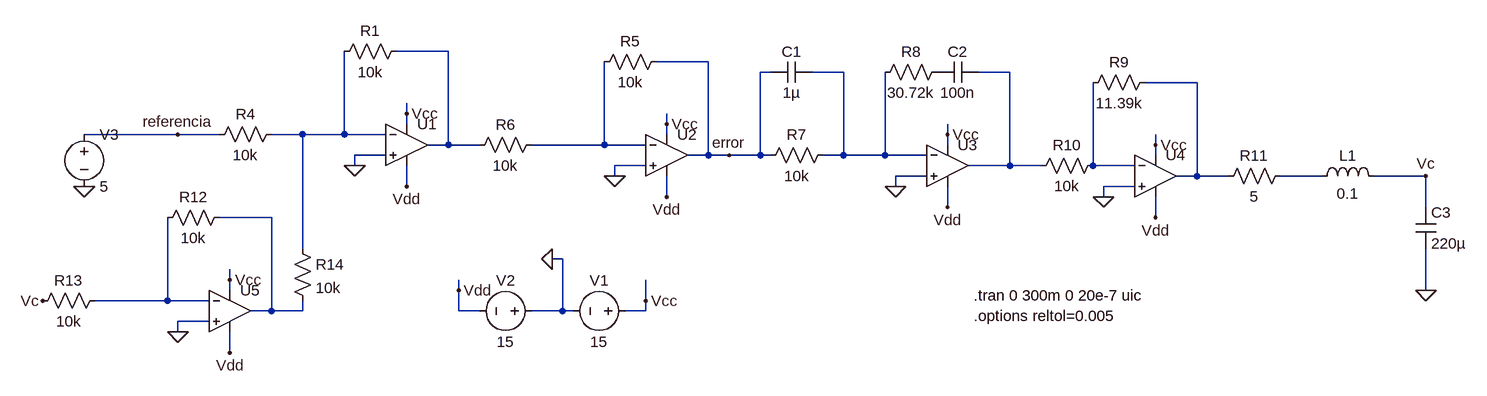
[diagram p0: schematic PID_circuito.asc]
PID_circuito.asc, the LTspice schematic file:
Version 4.1
SHEET 1 4532 732
WIRE 368 -16 288 -16
WIRE 768 0 688 0
WIRE 864 16 848 16
WIRE 976 16 928 16
WIRE 1232 16 1184 16
WIRE 1520 32 1440 32
WIRE 304 80 304 64
WIRE 304 96 304 80
WIRE 704 96 704 80
WIRE -48 112 -192 112
WIRE 16 112 -48 112
WIRE 144 112 96 112
WIRE 208 112 208 -16
WIRE 208 112 144 112
WIRE 272 112 208 112
WIRE 704 112 704 96
WIRE 1136 112 1136 96
WIRE 368 128 368 -16
WIRE 368 128 336 128
WIRE 416 128 368 128
WIRE 608 128 608 0
WIRE 608 128 496 128
WIRE 672 128 608 128
WIRE 1136 128 1136 112
WIRE 1456 128 1456 112
WIRE 272 144 224 144
WIRE 768 144 768 0
WIRE 768 144 736 144
WIRE 800 144 768 144
WIRE 848 144 848 16
WIRE 848 144 800 144
WIRE 864 144 848 144
WIRE 976 144 976 16
WIRE 976 144 944 144
WIRE 1040 144 1040 16
WIRE 1040 144 976 144
WIRE 1104 144 1040 144
WIRE 1456 144 1456 128
WIRE 224 160 224 144
WIRE 672 160 624 160
WIRE 1232 160 1232 16
WIRE 1232 160 1168 160
WIRE 1280 160 1232 160
WIRE 1360 160 1360 32
WIRE 1424 160 1360 160
WIRE 624 176 624 160
WIRE 1104 176 1056 176
WIRE 1520 176 1520 32
WIRE 1520 176 1488 176
WIRE 1568 176 1520 176
WIRE 1712 176 1648 176
WIRE 1872 176 1792 176
WIRE 304 192 304 160
WIRE 1056 192 1056 176
WIRE 1424 192 1376 192
WIRE 704 208 704 176
WIRE 1376 208 1376 192
WIRE 1136 224 1136 192
WIRE 1872 224 1872 176
WIRE 96 240 16 240
WIRE 1456 240 1456 208
WIRE 144 288 144 112
WIRE 544 304 528 304
WIRE 32 336 32 320
WIRE 32 352 32 336
WIRE 384 352 384 336
WIRE 1872 352 1872 288
WIRE -64 368 -64 240
WIRE -64 368 -176 368
WIRE 0 368 -64 368
WIRE 672 368 672 336
WIRE 96 384 96 240
WIRE 96 384 64 384
WIRE 144 384 144 368
WIRE 144 384 96 384
WIRE 384 384 384 352
WIRE 416 384 384 384
WIRE 544 384 544 304
WIRE 544 384 496 384
WIRE 560 384 544 384
WIRE 672 384 672 368
WIRE 672 384 640 384
WIRE 0 400 -48 400
WIRE -48 416 -48 400
WIRE 32 448 32 416
FLAG 304 192 Vdd
FLAG 304 80 Vcc
FLAG 224 160 0
FLAG 528 304 0
FLAG 672 368 Vcc
FLAG 384 352 Vdd
FLAG 704 208 Vdd
FLAG 704 96 Vcc
FLAG 624 176 0
FLAG 1136 224 Vdd
FLAG 1136 112 Vcc
FLAG 1056 192 0
FLAG 1456 240 Vdd
FLAG 1456 128 Vcc
FLAG 1376 208 0
FLAG 1872 352 0
FLAG 1872 176 Vc
FLAG 32 448 Vdd
FLAG 32 336 Vcc
FLAG -48 416 0
FLAG -256 368 Vc
FLAG 800 144 error
FLAG -192 192 0
FLAG -48 112 referencia
SYMBOL res 304 -32 R90
WINDOW 0 0 56 VBottom 2
WINDOW 3 32 56 VTop 2
SYMATTR InstName R1
SYMATTR Value 10k
SYMBOL OpAmps\\UniversalOpAmp2 304 128 R0
SYMATTR InstName U1
SYMBOL voltage 656 384 R90
WINDOW 0 -32 56 VBottom 2
WINDOW 3 32 56 VTop 2
SYMATTR InstName V1
SYMATTR Value 15
SYMBOL voltage 512 384 R90
WINDOW 0 -32 56 VBottom 2
WINDOW 3 32 56 VTop 2
SYMATTR InstName V2
SYMATTR Value 15
SYMBOL res 112 96 R90
WINDOW 0 0 56 VBottom 2
WINDOW 3 32 56 VTop 2
SYMATTR InstName R4
SYMATTR Value 10k
SYMBOL res 704 -16 R90
WINDOW 0 0 56 VBottom 2
WINDOW 3 32 56 VTop 2
SYMATTR InstName R5
SYMATTR Value 10k
SYMBOL OpAmps\\UniversalOpAmp2 704 144 R0
SYMATTR InstName U2
SYMBOL res 512 112 R90
WINDOW 0 0 56 VBottom 2
WINDOW 3 32 56 VTop 2
SYMATTR InstName R6
SYMATTR Value 10k
SYMBOL res 960 128 R90
WINDOW 0 0 56 VBottom 2
WINDOW 3 32 56 VTop 2
SYMATTR InstName R7
SYMATTR Value 10k
SYMBOL cap 928 0 R90
WINDOW 0 0 32 VBottom 2
WINDOW 3 32 32 VTop 2
SYMATTR InstName C1
SYMATTR Value 1µ
SYMBOL res 1136 0 R90
WINDOW 0 0 56 VBottom 2
WINDOW 3 32 56 VTop 2
SYMATTR InstName R8
SYMATTR Value 30.72k
SYMBOL OpAmps\\UniversalOpAmp2 1136 160 R0
SYMATTR InstName U3
SYMBOL cap 1184 0 R90
WINDOW 0 0 32 VBottom 2
WINDOW 3 32 32 VTop 2
SYMATTR InstName C2
SYMATTR Value 100n
SYMBOL res 1456 16 R90
WINDOW 0 0 56 VBottom 2
WINDOW 3 32 56 VTop 2
SYMATTR InstName R9
SYMATTR Value 11.39k
SYMBOL OpAmps\\UniversalOpAmp2 1456 176 R0
SYMATTR InstName U4
SYMBOL res 1376 144 R90
WINDOW 0 0 56 VBottom 2
WINDOW 3 32 56 VTop 2
SYMATTR InstName R10
SYMATTR Value 10k
SYMBOL res 1664 160 R90
WINDOW 0 0 56 VBottom 2
WINDOW 3 32 56 VTop 2
SYMATTR InstName R11
SYMATTR Value 5
SYMBOL ind 1696 192 R270
WINDOW 0 32 56 VTop 2
WINDOW 3 5 56 VBottom 2
SYMATTR InstName L1
SYMATTR Value 0.1
SYMBOL cap 1856 224 R0
SYMATTR InstName C3
SYMATTR Value 220µ
SYMBOL res 32 224 R90
WINDOW 0 0 56 VBottom 2
WINDOW 3 32 56 VTop 2
SYMATTR InstName R12
SYMATTR Value 10k
SYMBOL OpAmps\\UniversalOpAmp2 32 384 R0
SYMATTR InstName U5
SYMBOL res -160 352 R90
WINDOW 0 0 56 VBottom 2
WINDOW 3 32 56 VTop 2
SYMATTR InstName R13
SYMATTR Value 10k
SYMBOL res 128 272 R0
SYMATTR InstName R14
SYMATTR Value 10k
SYMBOL voltage -192 96 R0
WINDOW 123 0 0 Left 0
WINDOW 39 0 0 Left 0
SYMATTR InstName V3
SYMATTR Value 5
TEXT 1176 360 Left 2 !.tran 0 300m 0 20e-7 uic\n.options reltol=0.005

The netlist it stands for:
* PID_circuito.asc
R1 N001 N005 10k
X§U1 0 N005 Vcc Vdd N001 level2 Avol=1Meg GBW=10Meg Slew=10Meg Ilimit=25m Rail=0 Vos=0 En=0 Enk=0 In=0 Ink=0 Rin=500Meg  ; pins In+ In- V+ V- OUT
V1 Vcc 0 15
V2 0 Vdd 15
R4 N005 referencia 10k
R5 error N006 10k
X§U2 0 N006 Vcc Vdd error level2 Avol=1Meg GBW=10Meg Slew=10Meg Ilimit=25m Rail=0 Vos=0 En=0 Enk=0 In=0 Ink=0 Rin=500Meg  ; pins In+ In- V+ V- OUT
R6 N006 N001 10k
R7 N002 error 10k
C1 N002 error 1µ
R8 P001 N002 30.72k
X§U3 0 N002 Vcc Vdd N003 level2 Avol=1Meg GBW=10Meg Slew=10Meg Ilimit=25m Rail=0 Vos=0 En=0 Enk=0 In=0 Ink=0 Rin=500Meg  ; pins In+ In- V+ V- OUT
C2 N003 P001 100n
R9 N004 N007 11.39k
X§U4 0 N007 Vcc Vdd N004 level2 Avol=1Meg GBW=10Meg Slew=10Meg Ilimit=25m Rail=0 Vos=0 En=0 Enk=0 In=0 Ink=0 Rin=500Meg  ; pins In+ In- V+ V- OUT
R10 N007 N003 10k
R11 N008 N004 5
L1 N008 Vc 0.1
C3 Vc 0 220µ
R12 N009 N010 10k
X§U5 0 N010 Vcc Vdd N009 level2 Avol=1Meg GBW=10Meg Slew=10Meg Ilimit=25m Rail=0 Vos=0 En=0 Enk=0 In=0 Ink=0 Rin=500Meg  ; pins In+ In- V+ V- OUT
R13 N010 Vc 10k
R14 N005 N009 10k
V3 referencia 0 5
.tran 0 300m 0 20e-7 uic
.options reltol=0.005
.lib UniversalOpAmp2.lib
.backanno
.end